# EAGLE design Piano (EAGLE 9.6.1)
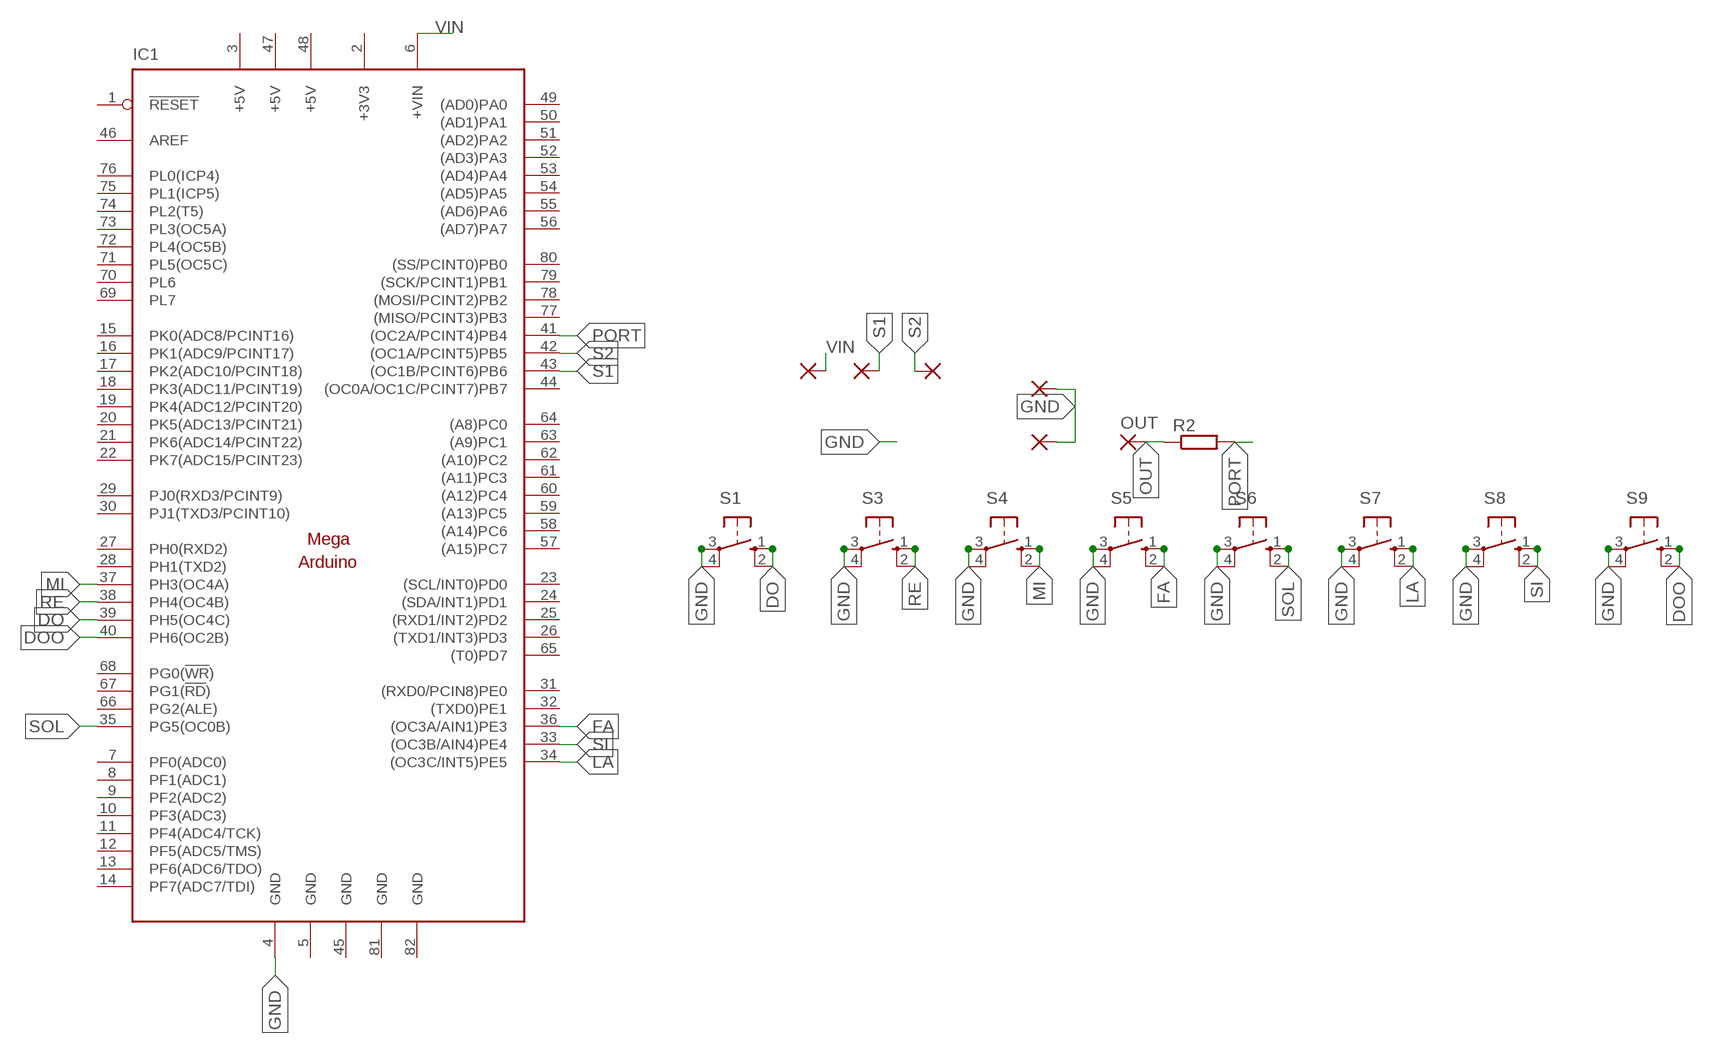
[diagram p0: schematic, sheet 1]

## Parts
IC1  MEGAARDUINO_12  [MEGA_ARDUINO_2]
OUT  2,54/1,1  [2,54/1,1]
PAD1  2,54/1,1  [2,54/1,1]
PAD2  2,54/1,1  [2,54/1,1]
PAD3  2,54/1,1  [2,54/1,1]
PAD4  2,54/1,1  [2,54/1,1]
PAD5  2,54/1,1  [2,54/1,1]
R2  R-EU_0411/12  [0411/12]
S1  40-XX  [B3F-40XX]
S3  40-XX  [B3F-40XX]
S4  40-XX  [B3F-40XX]
S5  40-XX  [B3F-40XX]
S6  40-XX  [B3F-40XX]
S7  40-XX  [B3F-40XX]
S8  40-XX  [B3F-40XX]
S9  40-XX  [B3F-40XX]

## Nets
DO: IC1.39(PH5(OC4C)) S1.1(S) S1.2(S1)
DOO: IC1.40(PH6(OC2B)) S9.1(S) S9.2(S1)
FA: IC1.36((OC3A/AIN1)PE3) S5.1(S) S5.2(S1)
GND: IC1.4(GND) PAD1.1(P) PAD2.1(P) S1.3(P) S1.4(P1) S3.3(P) S3.4(P1) S4.3(P) S4.4(P1) S5.3(P) S5.4(P1) S6.3(P) S6.4(P1) S7.3(P) S7.4(P1) S8.3(P) S8.4(P1) S9.3(P) S9.4(P1)
LA: IC1.34((OC3C/INT5)PE5) S7.1(S) S7.2(S1)
MI: IC1.37(PH3(OC4A)) S4.1(S) S4.2(S1)
OUT: OUT.1(P) R2.1
PORT: IC1.41((OC2A/PCINT4)PB4) R2.2
RE: IC1.38(PH4(OC4B)) S3.1(S) S3.2(S1)
S1: IC1.43((OC1B/PCINT6)PB6) PAD3.1(P)
S2: IC1.42((OC1A/PCINT5)PB5) PAD4.1(P)
SI: IC1.33((OC3B/AIN4)PE4) S8.1(S) S8.2(S1)
SOL: IC1.35(PG5(OC0B)) S6.1(S) S6.2(S1)
VIN: IC1.6(+VIN) PAD5.1(P)
Unconnected: IC1.1(!RESET) IC1.7(PF0(ADC0)) IC1.8(PF1(ADC1)) IC1.9(PF2(ADC2)) IC1.10(PF3(ADC3)) IC1.11(PF4(ADC4/TCK)) IC1.12(PF5(ADC5/TMS)) IC1.13(PF6(ADC6/TDO)) IC1.14(PF7(ADC7/TDI)) IC1.15(PK0(ADC8/PCINT16)) IC1.16(PK1(ADC9/PCINT17)) IC1.17(PK2(ADC10/PCINT18)) IC1.18(PK3(ADC11/PCINT19)) IC1.19(PK4(ADC12/PCINT20)) IC1.20(PK5(ADC13/PCINT21)) IC1.21(PK6(ADC14/PCINT22)) IC1.22(PK7(ADC15/PCINT23)) IC1.23((SCL/INT0)PD0) IC1.24((SDA/INT1)PD1) IC1.25((RXD1/INT2)PD2) IC1.26((TXD1/INT3)PD3) IC1.27(PH0(RXD2)) IC1.28(PH1(TXD2)) IC1.29(PJ0(RXD3/PCINT9)) IC1.30(PJ1(TXD3/PCINT10)) IC1.31((RXD0/PCIN8)PE0) IC1.32((TXD0)PE1) IC1.44((OC0A/OC1C/PCINT7)PB7) IC1.46(AREF) IC1.49((AD0)PA0) IC1.50((AD1)PA1) IC1.51((AD2)PA2) IC1.52((AD3)PA3) IC1.53((AD4)PA4) IC1.54((AD5)PA5) IC1.55((AD6)PA6) IC1.56((AD7)PA7) IC1.57((A15)PC7) IC1.58((A14)PC6) IC1.59((A13)PC5) IC1.60((A12)PC4) IC1.61((A11)PC3) IC1.62((A10)PC2) IC1.63((A9)PC1) IC1.64((A8)PC0) IC1.65((T0)PD7) IC1.66(PG2(ALE)) IC1.67(PG1(!RD!)) IC1.68(PG0(!WR!)) IC1.69(PL7) IC1.70(PL6) IC1.71(PL5(OC5C)) IC1.72(PL4(OC5B)) IC1.73(PL3(OC5A)) IC1.74(PL2(T5)) IC1.75(PL1(ICP5)) IC1.76(PL0(ICP4)) IC1.77((MISO/PCINT3)PB3) IC1.78((MOSI/PCINT2)PB2) IC1.79((SCK/PCINT1)PB1) IC1.80((SS/PCINT0)PB0)

## Power pins joined to a net without a drawn wire
+3V3: IC1.2(+3V3)
+5V: IC1.3(+5V) IC1.47(+5V) IC1.48(+5V)
GND: IC1.5(GND) IC1.45(GND) IC1.81(GND) IC1.82(GND)

## Library data of the parts
IC1 = arduino (1):MEGAARDUINO_1: The Arduino Mega is a microcontroller board based on the ATmega1280. - 54 digital input/output pins (of which 14 can be used as PWM outputs) - 16 analog inputs - 4 UARTs (hardware serial ports) - 16 MHz crystal oscillator - USB connection - power jack - ICSP header - reset button It contains everything needed to support the microcontroller; simply connect it to a computer with a USB cable or power it with a AC-to-DC adapter or battery to get started. The Mega is compatible with most shields designed for the Arduino Duemilanove or Diecimila. http://arduino.cc/en/Main/ArduinoBoardMega
OUT PAD1-PAD5 = wirepad:2,54/1,1: THROUGH-HOLE PAD
R2 = rcl:R-EU_: RESISTOR, European symbol; SPICEPREFIX: R
S1 S3-S9 = switch-omron:40-XX: OMRON SWITCH

## Board
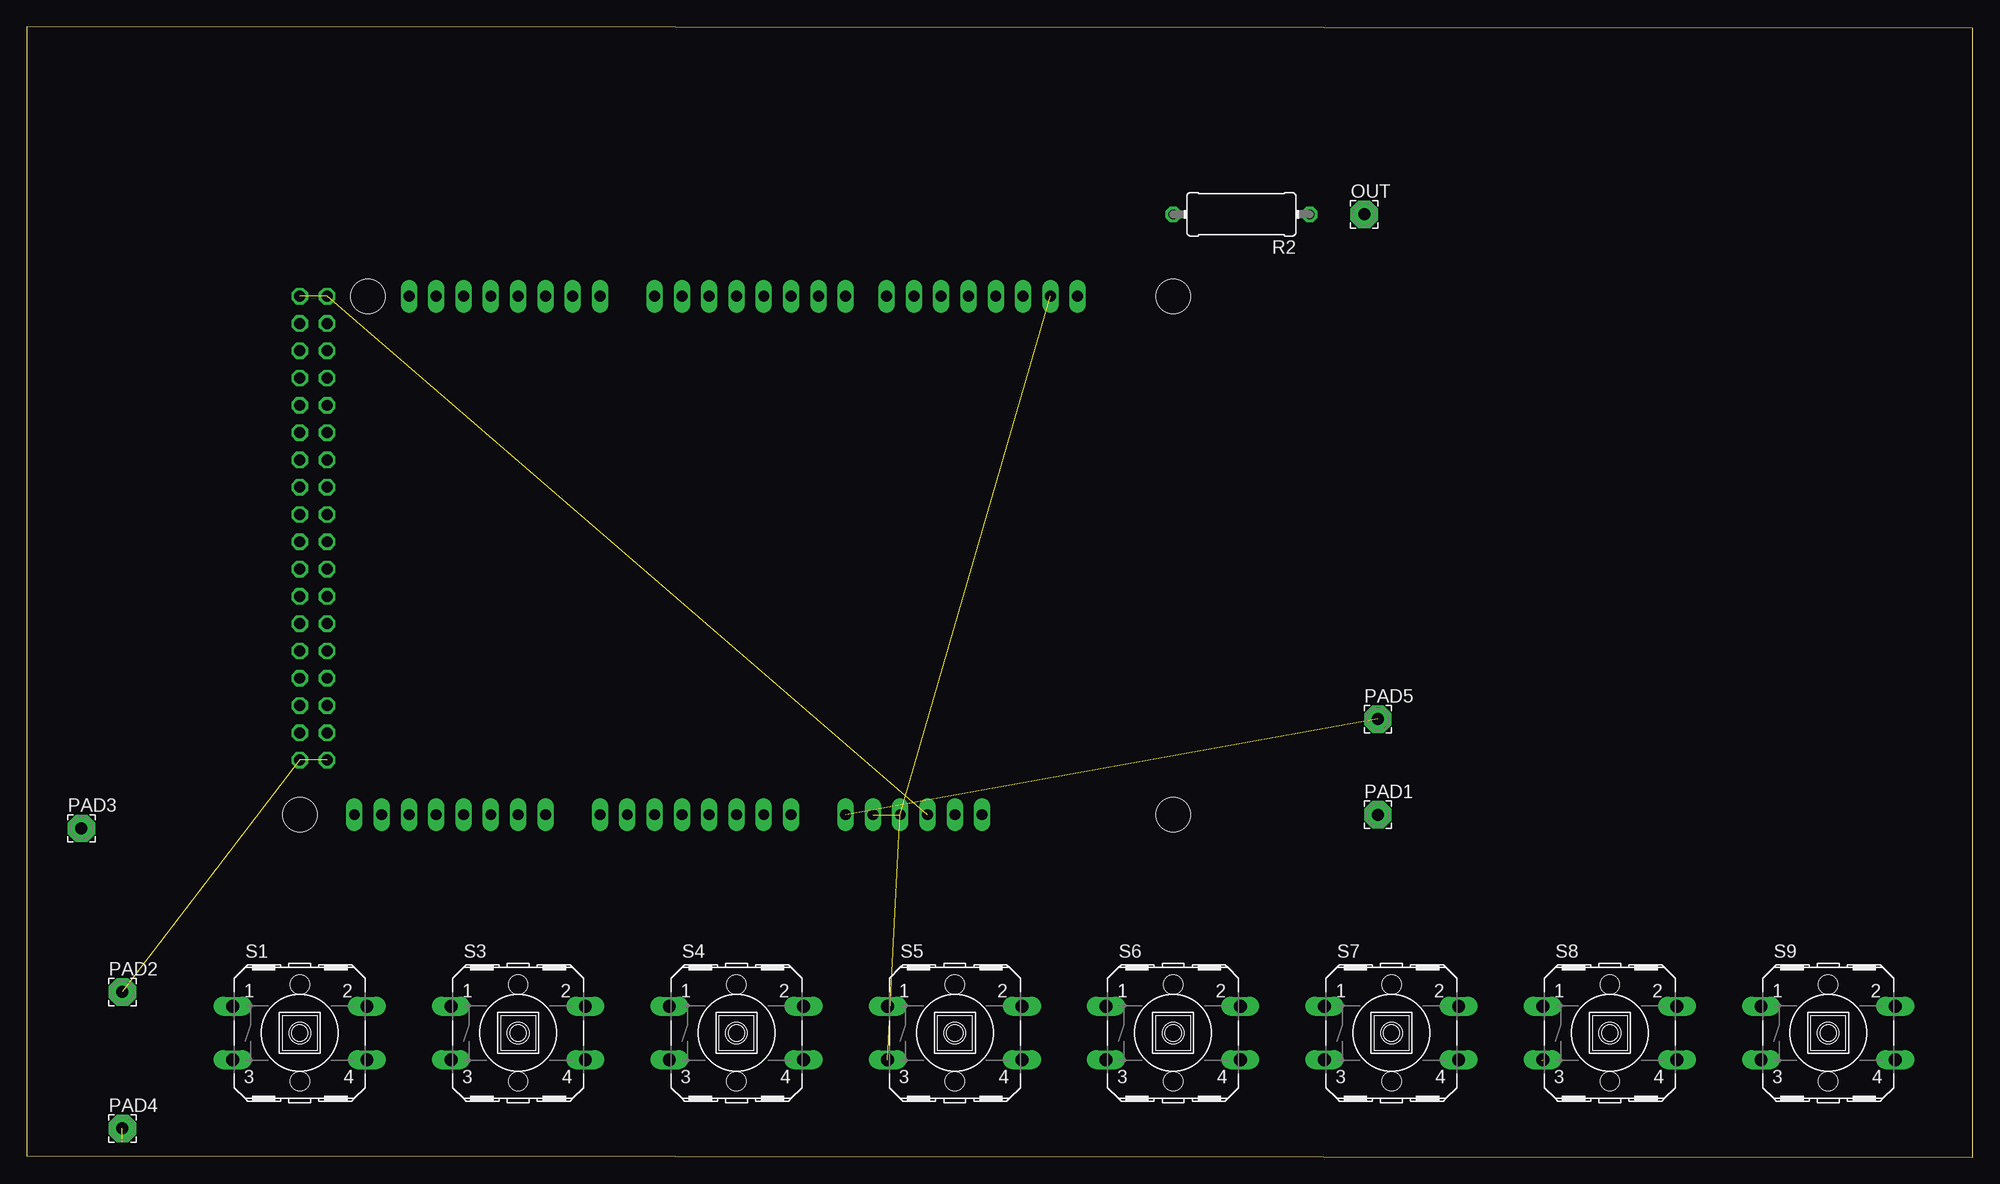
[diagram p1: board, top side]
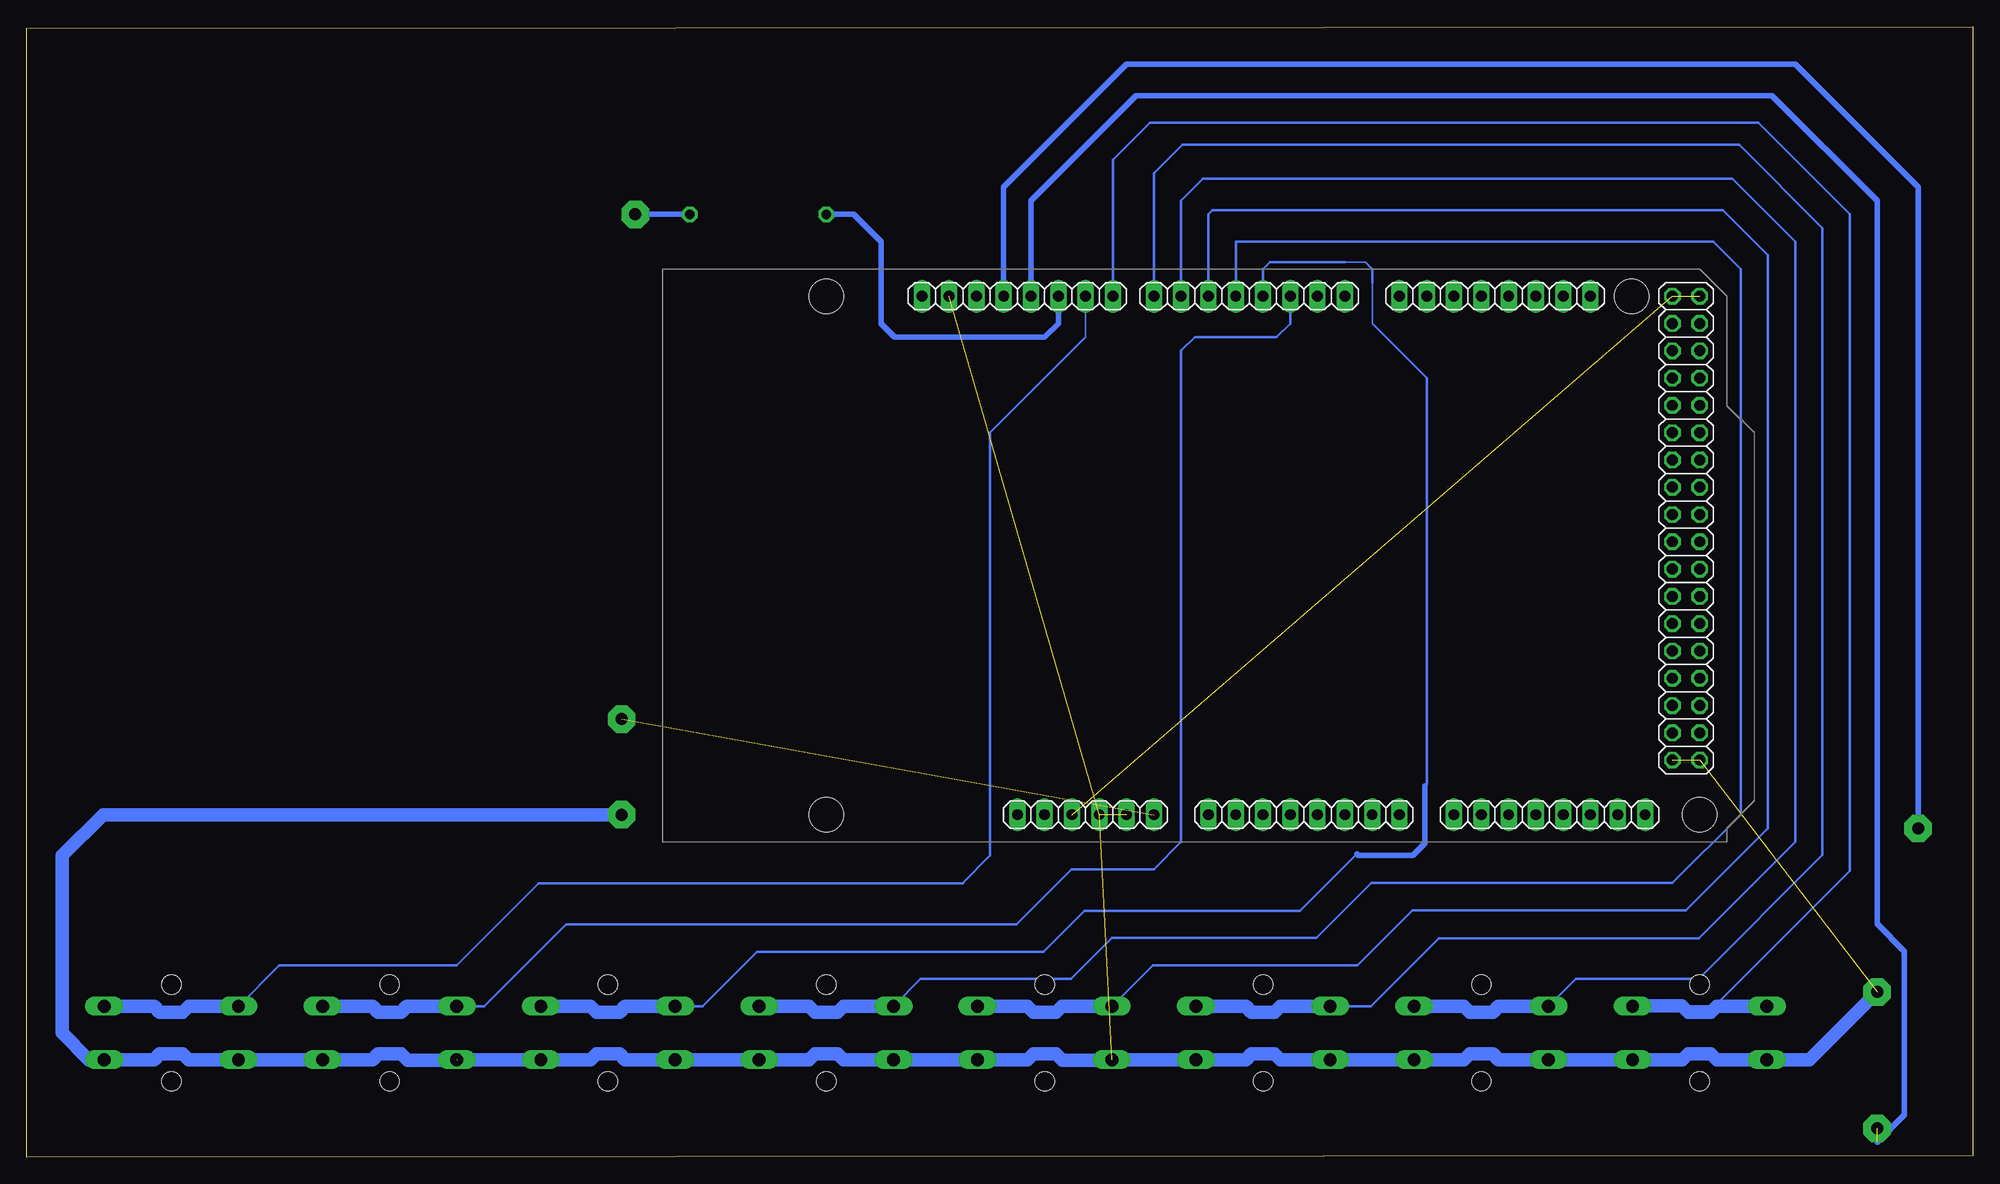
[diagram p2: board, bottom side, seen from below]

Size 181.08 x 105.21 mm. Coordinates in mm from the lower left corner, seen from the top.
Outline: 0,0.13 181.08,0 181.08,105.08 0,105.21 0,0.13
Copper layers (1*16): Top 0.035mm / dielectric 1.5mm / Bottom 0.035mm
Design rules "default": minimum track width 6mil, minimum drill 0.35mm, track to track 6mil, track to pad 6mil, pad to pad 6mil, via to via 6mil, smd to smd 6mil, copper to edge 40mil, drill to drill 6mil, minimum pad ring 10mil, minimum via ring 8mil, stop-mask expansion 4mil, vias tented up to drill 0mil, thermal gap 10mil

### Footprints (pad centres in the part's own frame; a part is rotated, then mirrored left to right if it is on the bottom)
MEGA_ARDUINO_2 = drill 1.016 long: 1 33.02,2.54; 2 35.56,2.54; 3 38.1,2.54; 4 40.64,2.54; 5 43.18,2.54; 6 45.72,2.54; 7 50.8,2.54; 8 53.34,2.54; 9 55.88,2.54; 10 58.42,2.54; 11 60.96,2.54; 12 63.5,2.54; 13 66.04,2.54; 14 68.58,2.54; 15 73.66,2.54; 16 76.2,2.54; 17 78.74,2.54; 18 81.28,2.54; 19 83.82,2.54; 20 86.36,2.54; 21 88.9,2.54; 22 91.44,2.54; 23 86.36,50.8; 24 83.82,50.8; 25 81.28,50.8; 26 78.74,50.8; 27 76.2,50.8; 28 73.66,50.8; 29 71.12,50.8; 30 68.58,50.8; 31 63.5,50.8; 32 60.96,50.8; 33 58.42,50.8; 34 55.88,50.8; 35 53.34,50.8; 36 50.8,50.8; 37 48.26,50.8; 38 45.72,50.8; 39 41.91,50.8; 40 39.37,50.8; 41 36.83,50.8; 42 34.29,50.8; 43 31.75,50.8; 44 29.21,50.8; 45 26.67,50.8; 46 24.13,50.8 | drill 1.016 octagon: 47 93.98,50.8; 48 96.52,50.8; 49 93.98,48.26; 50 96.52,48.26; 51 93.98,45.72; 52 96.52,45.72; 53 93.98,43.18; 54 96.52,43.18; 55 93.98,40.64; 56 96.52,40.64; 57 93.98,38.1; 58 96.52,38.1; 59 93.98,35.56; 60 96.52,35.56; 61 93.98,33.02; 62 96.52,33.02; 63 93.98,30.48; 64 96.52,30.48; 65 93.98,27.94; 66 96.52,27.94; 67 93.98,25.4; 68 96.52,25.4; 69 93.98,22.86; 70 96.52,22.86; 71 93.98,20.32; 72 96.52,20.32; 73 93.98,17.78; 74 96.52,17.78; 75 93.98,15.24; 76 96.52,15.24; 77 93.98,12.7; 78 96.52,12.7; 79 93.98,10.16; 80 96.52,10.16; 81 93.98,7.62; 82 96.52,7.62 | hole 3.2: 15.24,50.8; 15.24,2.54; 90.17,50.8; 96.52,2.54
2,54/1,1 = drill 1.118 pad 2.54 octagon: 1 0,0
0411/12 = drill 0.914 octagon: 1 -6.35,0; 2 6.35,0
B3F-40XX = drill 1.194 long: 1 -6.248,2.489; 2 6.248,2.489; 3 -6.248,-2.489; 4 6.248,-2.489 | hole 1.803: 0,-4.496; 0,4.496

### Placement (x,y rotation side)
IC1  121.92,29.34 0 bottom
OUT  124.46,87.76 0 top
PAD1  125.73,31.88 0 top
PAD2  8.89,15.37 0 top
PAD3  5.08,30.61 0 top
PAD4  8.89,2.67 0 top
PAD5  125.73,40.77 0 top
R2  113.03,87.76 180 top
S1  25.4,11.56 0 top
S3  45.72,11.56 0 top
S4  66.04,11.56 0 top
S5  86.36,11.56 0 top
S6  106.68,11.56 0 top
S7  127,11.56 0 top
S8  147.32,11.56 0 top
S9  167.64,11.56 0 top

### Tracks (layer width: path | path; a pad name or v marks a point on that pad's centre or on a via)
+5V  (2 unrouted)
DO
  Bottom 0.254: S1.2 24.03,14.05 11.43,26.64 11.43,87.76 19.94,96.27 76.58,96.27 80.01,92.84 IC1.39
  Bottom 1.27: S1.1 23.8,14.05 24.34,13.5 26.46,13.5 27.05,14.1 31.75,14.1 31.7,14.05 S1.2
DOO
  Bottom 0.152: 91.44,28.07 93.98,25.53 93.98,25.48 | IC1.40 82.55,76.33 91.44,67.44
  Bottom 0.254: S9.1 157.58,17.86 141.07,17.86 133.45,25.48 93.98,25.48 | 91.44,67.44 91.44,28.07
  Bottom 1.27: S9.1 166.04,14.05 166.58,13.5 168.7,13.5 169.24,14.05 S9.2
FA
  Bottom 0.254: S5.1 76.3,17.86 57.25,17.86 52.12,22.99 26.67,22.99 19.05,30.61 19.05,83.95 23.24,88.14 70.74,88.14 71.12,87.76 IC1.36
  Bottom 1.27: S5.1 84.76,14.05 85.3,13.5 87.42,13.5 87.96,14.05 S5.2
GND  (6 unrouted)
  Bottom 1.27: 140.97,9.02 145.67,9.02 146.26,9.61 148.38,9.61 148.92,9.07 S8.4 S9.3 166.04,9.07 166.58,9.61 168.7,9.61 169.24,9.07 S9.4 175.31,9.07 177.8,11.56 177.8,28.07 173.99,31.88 PAD1.1 | S8.3 S7.4 128.6,9.07 128.06,9.61 125.94,9.61 125.4,9.07 S7.3 S6.4 108.28,9.07 107.74,9.61 105.62,9.61 105.08,9.07 S6.3 S5.4 87.96,9.07 87.42,9.61 85.3,9.61 84.71,9.02 80.01,9.02 80.06,9.07 S5.3 S4.4 67.64,9.07 67.1,9.61 64.98,9.61 64.44,9.07 S4.3 S3.4 47.32,9.07 46.78,9.61 44.66,9.61 44.12,9.07 S3.3 S1.4 27,9.07 26.46,9.61 24.34,9.61 23.8,9.07 S1.3 15.19,9.07 PAD2.1
LA
  Bottom 0.152: 50.8,72.52 55.88,77.6 55.88,81.41 | 55.88,82.68 56.52,83.31 58.42,83.31
  Bottom 0.254: S7.1 118.21,14.05 113.13,19.13 86.46,19.13 82.65,22.94 62.59,22.94 57.3,28.22 | 50.95,34.57 50.8,34.72 50.8,72.52 | IC1.34 66.04,82.68 65.41,83.31 58.42,83.31 | 55.88,81.41 55.88,82.68
  Bottom 0.508: 50.95,34.57 50.95,29.18 52.07,28.07 57.15,28.07 57.3,28.22
  Bottom 1.27: S7.1 125.4,14.05 125.94,13.5 128.06,13.5 128.6,14.05 S7.2
MI
  Bottom 0.254: S4.1 55.98,14.05 49.68,20.34 25.5,20.34 16.51,29.34 16.51,85.22 22.35,91.06 71.63,91.06 73.66,89.03 IC1.37
  Bottom 1.27: S4.1 64.44,14.05 64.98,13.5 67.1,13.5 67.64,14.05 S4.2
OUT
  Bottom 0.508: R2.1 OUT.1
PORT
  Bottom 0.508: IC1.41 85.09,77.6 86.36,76.33 100.33,76.33 101.6,77.6 101.6,85.22 104.14,87.76 R2.2
RE
  Bottom 0.254: S3.1 36.93,16.59 25.5,16.59 13.97,28.12 13.97,86.49 21.72,94.23 73.53,94.23 76.2,91.57 IC1.38
  Bottom 1.27: S3.1 44.12,14.05 44.66,13.5 46.78,13.5 47.32,14.05 S3.2
S1
  Bottom 0.508: PAD3.1 5.08,90.3 16.51,101.73 78.74,101.73 90.17,90.3 IC1.43
S2  (1 unrouted)
  Bottom 0.508: IC1.42 87.63,89.03 77.85,98.81 18.67,98.81 8.89,89.03 8.89,21.72 6.35,19.18 6.35,3.94 8.89,1.4
SI
  Bottom 0.152: 72.39,76.33 73.66,75.06
  Bottom 0.254: S8.1 138.53,14.05 130.91,21.67 89,21.67 83.87,26.8 76.2,26.8 73.66,29.34 73.66,75.06 | 72.39,76.33 64.77,76.33 63.5,77.6 IC1.33
  Bottom 1.27: S8.1 145.72,14.05 146.26,13.5 148.38,13.5 148.92,14.05 S8.2
SOL
  Bottom 0.254: S6.1 97.89,16.59 83.92,16.59 80.11,20.4 61.06,20.4 55.93,25.53 27.94,25.53 21.59,31.88 21.59,82.68 24.13,85.22 68.58,85.22 IC1.35
  Bottom 1.27: S6.1 105.08,14.05 105.62,13.5 107.74,13.5 108.28,14.05 S6.2
VIN  (1 unrouted)